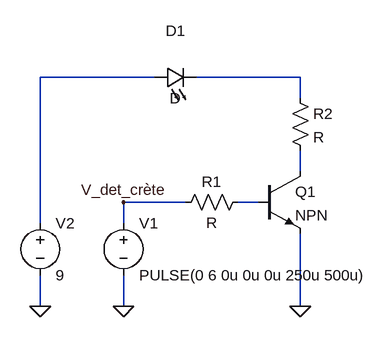
[diagram p0: schematic led.asc]
led.asc, the LTspice schematic file:
Version 4.1
SHEET 1 880 680
WIRE 144 -96 -32 -96
WIRE 368 -96 208 -96
WIRE 368 -64 368 -96
WIRE 368 48 368 16
WIRE 192 96 96 96
WIRE 304 96 272 96
WIRE -32 128 -32 -96
WIRE 96 128 96 96
WIRE -32 256 -32 208
WIRE 96 256 96 208
WIRE 368 256 368 144
FLAG -32 256 0
FLAG 96 256 0
FLAG 368 256 0
FLAG 96 96 V_det_crète
SYMBOL voltage 96 112 R0
WINDOW 123 0 0 Left 0
WINDOW 39 0 0 Left 0
SYMATTR InstName V1
SYMATTR Value PULSE(0 6 0u 0u 0u 250u 500u)
SYMBOL res 288 80 R90
WINDOW 0 0 56 VBottom 2
WINDOW 3 32 56 VTop 2
SYMATTR InstName R1
SYMBOL voltage -32 112 R0
WINDOW 123 0 0 Left 0
WINDOW 39 0 0 Left 0
SYMATTR InstName V2
SYMATTR Value 9
SYMBOL LED 144 -80 R270
WINDOW 0 72 32 VTop 2
WINDOW 3 0 32 VBottom 2
SYMATTR InstName D1
SYMBOL npn 304 48 R0
SYMATTR InstName Q1
SYMBOL res 352 -80 R0
SYMATTR InstName R2

The netlist it stands for:
* led.asc
V1 V_det_crète 0 PULSE(0 6 0u 0u 0u 250u 500u)
R1 N004 V_det_crète R
V2 N001 0 9
D1 N001 N002 D
Q1 N003 N004 0 0 NPN
R2 N002 N003 R
.model D D
.lib standard.dio
.model NPN NPN
.model PNP PNP
.lib standard.bjt
.backanno
.end